# EAGLE design LPEM (EAGLE 6.4)

## Sheet 1 of 2
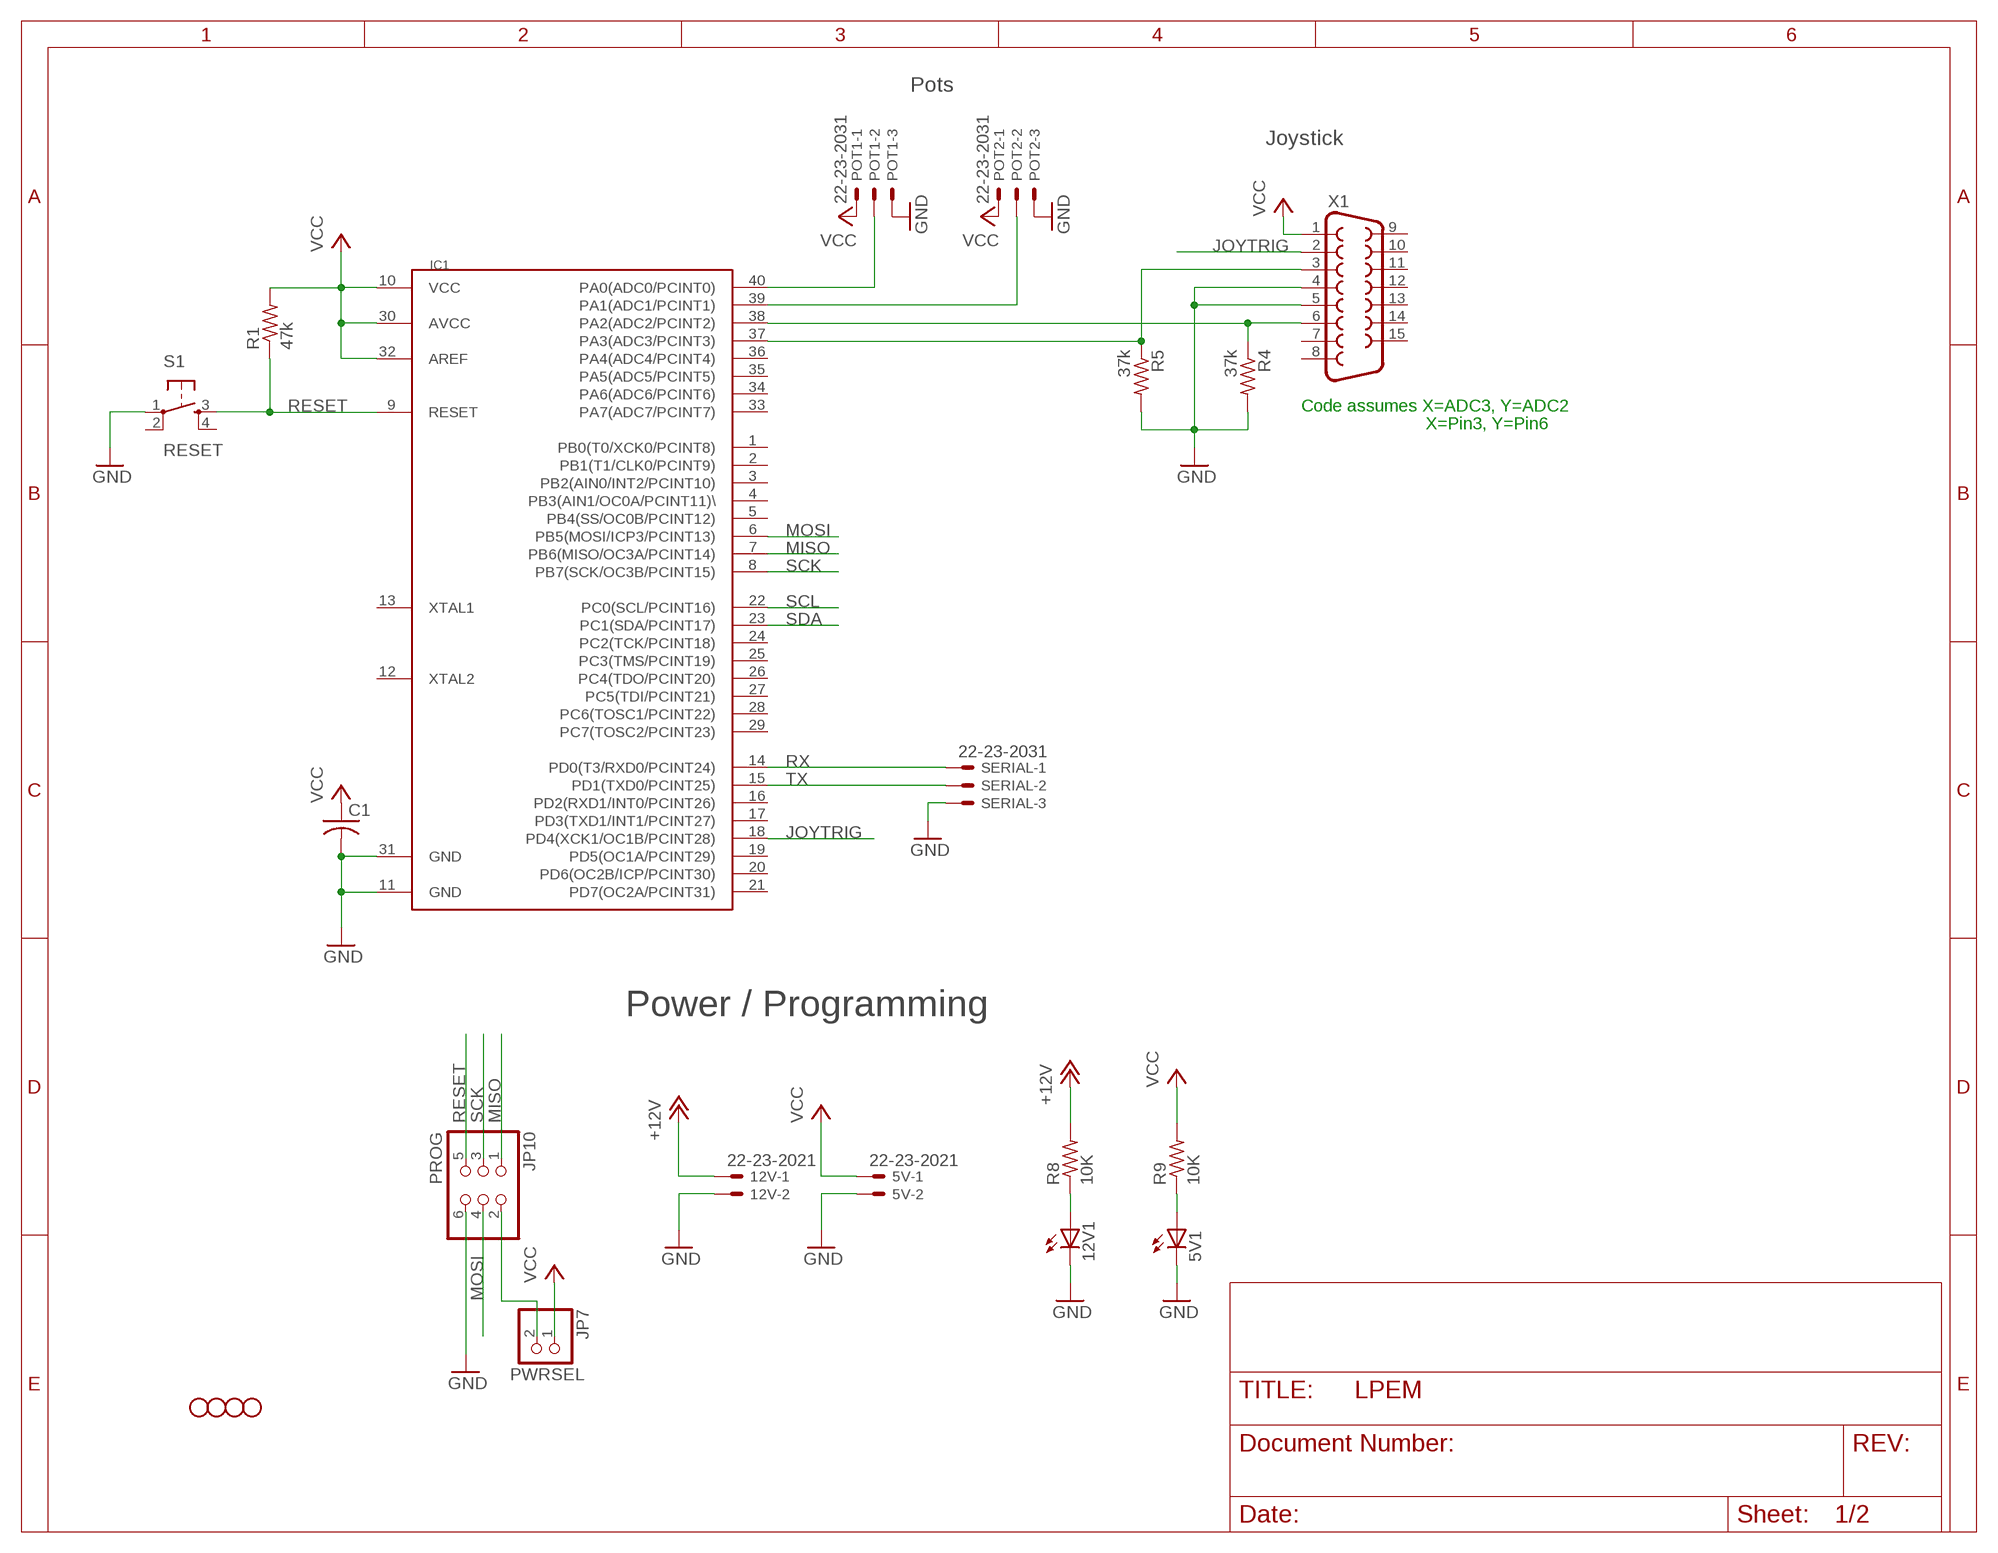
[diagram p0: schematic, sheet 1]

### Parts
5V  22-23-2021  [22-23-2021]
5V1  LED3MM  [LED3MM]
12V  22-23-2021  [22-23-2021]
12V1  LED3MM  [LED3MM]
C1  C-US025-025X050  [C025-025X050]
IC1  MEGA1284P  [DIL40]
JP1  STAND-OFF  [STAND-OFF]
JP2  STAND-OFF  [STAND-OFF]
JP7  PWRSEL  PINHD-1X2  [1X02]
JP8  STAND-OFF  [STAND-OFF]
JP9  STAND-OFF  [STAND-OFF]
JP10  PROG  PINHD-2X3  [2X03]
POT1  22-23-2031  [22-23-2031]
POT2  22-23-2031  [22-23-2031]
R1  47k  R-US_0204/5  [0204/5]
R4  37k  R-US_0204/5  [0204/5]
R5  37k  R-US_0204/5  [0204/5]
R8  10K  R-US_0204/5  [0204/5]
R9  10K  R-US_0204/5  [0204/5]
S1  RESET  TAC_SWITCHPTH  [TACTILE-PTH]
SERIAL  22-23-2031  [22-23-2031]
X1  F15HP  [F15HP]

### Nets
+12V [power]: 12V.1 R8.2 ; also sheet 2
GND [power]: 5V1.K(C) 5V.2 12V1.K(C) 12V.2 C1.2 IC1.11(GND) IC1.31(GND) JP10.6 POT1.3 POT2.3 R4.2 R5.2 S1.1 SERIAL.3 X1.4 X1.5 ; also sheet 2
JOYTRIG: IC1.18(PD4(XCK1/OC1B/PCINT28)) X1.2
MISO: IC1.7(PB6(MISO/OC3A/PCINT14)) JP10.1
MOSI: IC1.6(PB5(MOSI/ICP3/PCINT13)) JP10.4
N$1: IC1.40(PA0(ADC0/PCINT0)) POT1.2
N$2: IC1.39(PA1(ADC1/PCINT1)) POT2.2
N$3: IC1.37(PA3(ADC3/PCINT3)) R5.1 X1.3
N$4: JP7.2 JP10.2
N$5: 5V1.A R9.1
N$6: IC1.38(PA2(ADC2/PCINT2)) R4.1 X1.6
N$7: 12V1.A R8.1
RESET: IC1.9(RESET) JP10.5 R1.1 S1.3
RX: IC1.14(PD0(T3/RXD0/PCINT24)) SERIAL.1
SCK: IC1.8(PB7(SCK/OC3B/PCINT15)) JP10.3
SCL: IC1.22(PC0(SCL/PCINT16)) ; also sheet 2
SDA: IC1.23(PC1(SDA/PCINT17)) ; also sheet 2
TX: IC1.15(PD1(TXD0/PCINT25)) SERIAL.2
VCC [power]: 5V.1 C1.1 IC1.10(VCC) IC1.30(AVCC) IC1.32(AREF) JP7.1 POT1.1 POT2.1 R1.2 R9.2 X1.1 ; also sheet 2
Unconnected: IC1.1(PB0(T0/XCK0/PCINT8)) IC1.2(PB1(T1/CLK0/PCINT9)) IC1.3(PB2(AIN0/INT2/PCINT10)) IC1.4(PB3(AIN1/OC0A/PCINT11)\) IC1.5(PB4(SS/OC0B/PCINT12)) IC1.12(XTAL2) IC1.13(XTAL1) IC1.16(PD2(RXD1/INT0/PCINT26)) IC1.17(PD3(TXD1/INT1/PCINT27)) IC1.19(PD5(OC1A/PCINT29)) IC1.20(PD6(OC2B/ICP/PCINT30)) IC1.21(PD7(OC2A/PCINT31)) IC1.24(PC2(TCK/PCINT18)) IC1.25(PC3(TMS/PCINT19)) IC1.26(PC4(TDO/PCINT20)) IC1.27(PC5(TDI/PCINT21)) IC1.28(PC6(TOSC1/PCINT22)) IC1.29(PC7(TOSC2/PCINT23)) IC1.33(PA7(ADC7/PCINT7)) IC1.34(PA6(ADC6/PCINT6)) IC1.35(PA5(ADC5/PCINT5)) IC1.36(PA4(ADC4/PCINT4)) S1.2 S1.4 X1.7 X1.8 X1.9 X1.10 X1.11 X1.12 X1.13 X1.14 X1.15

### Notes on the sheet
- Pots
- Joystick
- Code assumes X=ADC3, Y=ADC2
- X=Pin3, Y=Pin6
- Power / Programming

## Sheet 2 of 2
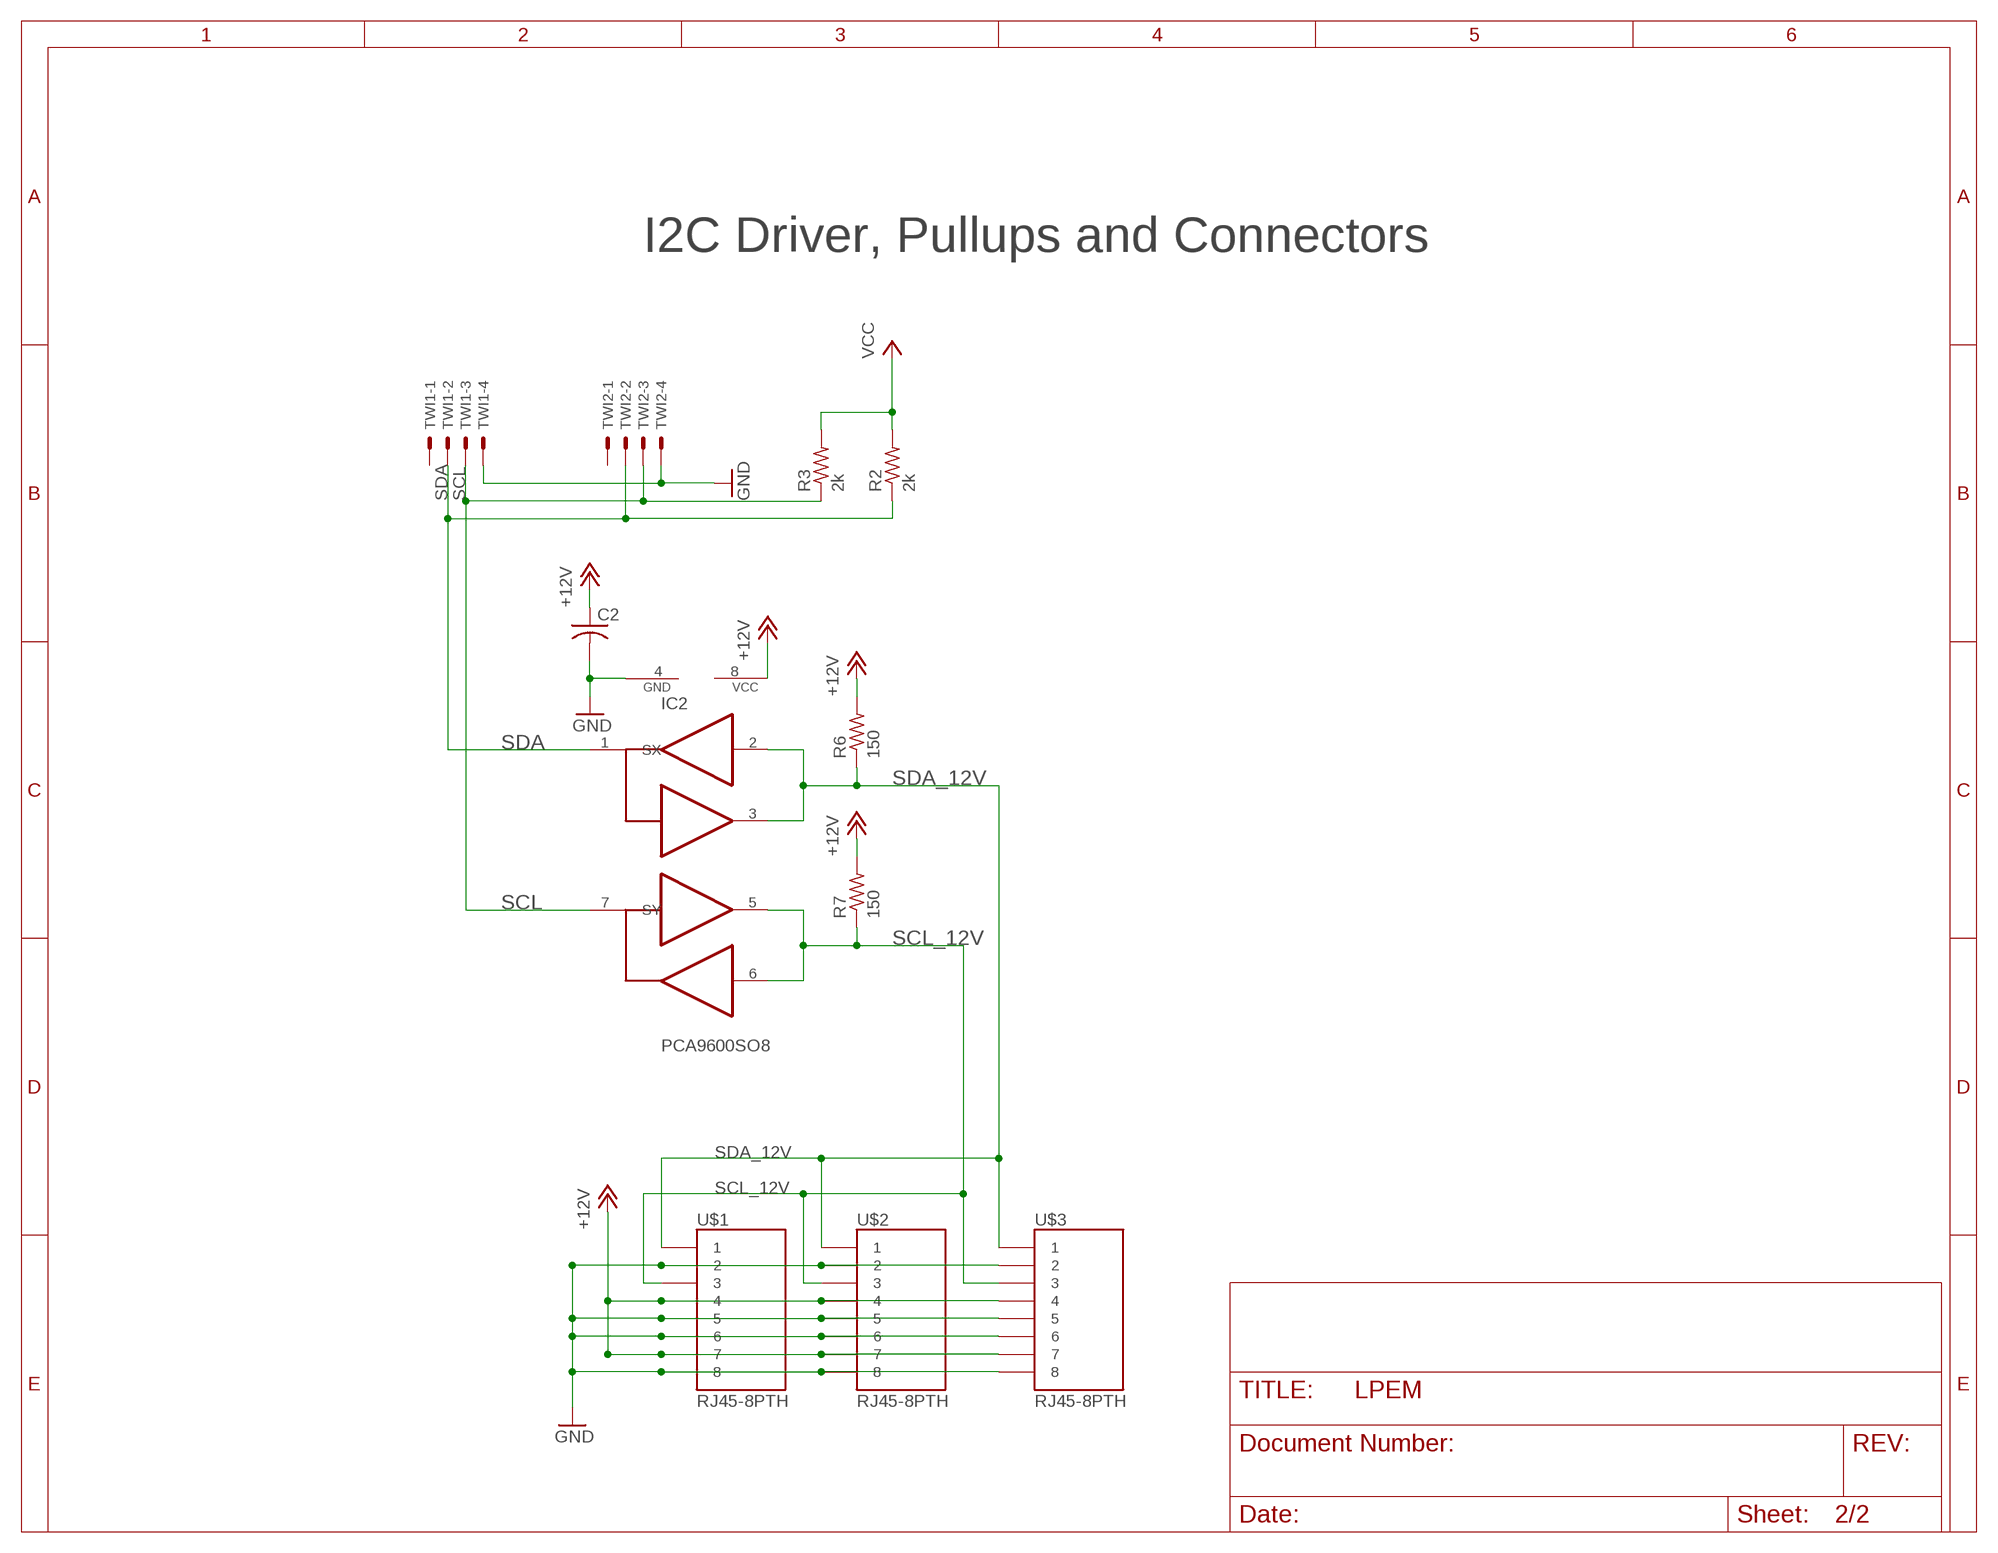
[diagram p1: schematic, sheet 2]

### Parts
C2  C-US025-025X050  [C025-025X050]
IC2  PCA9600SO8  [SO08]
R2  2k  R-US_0204/5  [0204/5]
R3  2k  R-US_0204/5  [0204/5]
R6  150  R-US_0204/5  [0204/5]
R7  150  R-US_0204/5  [0204/5]
TWI1  22-23-2041  [22-23-2041]
TWI2  22-23-2041  [22-23-2041]
U$1  RJ45-8PTH  [RJ45-8]
U$2  RJ45-8PTH  [RJ45-8]
U$3  RJ45-8PTH  [RJ45-8]

### Nets
+12V [power]: C2.1 IC2.8(VCC) R6.2 R7.2 U$1.4 U$1.7 U$2.4 U$2.7 U$3.4 U$3.7 ; also sheet 1
GND [power]: C2.2 IC2.4(GND) TWI1.4 TWI2.4 U$1.2 U$1.5 U$1.6 U$1.8 U$2.2 U$2.5 U$2.6 U$2.8 U$3.2 U$3.5 U$3.6 U$3.8 ; also sheet 1
SCL: IC2.7(SY) R3.1 TWI1.3 TWI2.3 ; also sheet 1
SCL_12V: IC2.5(TY) IC2.6(RY) R7.1 U$1.3 U$2.3 U$3.3
SDA: IC2.1(SX) R2.1 TWI1.2 TWI2.2 ; also sheet 1
SDA_12V: IC2.2(RX) IC2.3(TX) R6.1 U$1.1 U$2.1 U$3.1
VCC [power]: R2.2 R3.2 ; also sheet 1
Unconnected: TWI1.1 TWI2.1

### Notes on the sheet
- I2C Driver, Pullups and Connectors

## Library data of the parts
5V 12V = con-molex:22-23-2021: .100" (2.54mm) Center Header - 2 Pin
5V1 12V1 = led:LED: LED OSRAM: - CHIPLED LG R971, LG N971, LY N971, LG Q971, LY Q971, LO R971, LY R971 LH N974, LH R974 LS Q976, LO Q976, LY Q976 LO Q996 - Hyper CHIPLED LW Q18S LB Q993, LB Q99A, LB R99A - SideLED LS A670, LO A670, LY A670, LG A670, LP A670 LB A673, LV A673, LT A673, LW A673 LH A674 LY A675 LS A676, LA A676, LO A676, LY A676, LW A676 LS A679, LY A679, LG A679 - Hyper Micro SIDELED® LS Y876, LA Y876, LO Y876, LY Y876 LT Y87S - SmartLED LW L88C, LW L88S LB L89C, LB L89S, LG L890 LS L89K, LO L89K, LY L89K LS L896, LA L896, LO L896, LY L896 - TOPLED LS T670, LO T670, LY T670, LG T670, LP T670 LSG T670, LSP T670, LSY T670, LOP T670, LYG T670 LG T671, LOG T671, LSG T671 LB T673, LV T673, LT T673, LW T673 LH T674 LS T676, LA T676, LO T676, LY T676, LB T676, LH T676, LSB T676, LW T676 LB T67C, LV T67C, LT T67C, LS T67K, LO T67K, LY T67K, LW E67C LS E67B, LA E67B, LO E67B, LY E67B, LB E67C, LV E67C, LT E67C LW T67C LS T679, LY T679, LG T679 LS T770, LO T770, LY T770, LG T770, LP T770 LB T773, LV T773, LT T773, LW T773 LH T774 LS E675, LA E675, LY E675, LS T675 LS T776, LA T776, LO T776, LY T776, LB T776 LHGB T686 LT T68C, LB T68C - Hyper Mini TOPLED® LB M676 - Mini TOPLED Santana® LG M470 LS M47K, LO M47K, LY M47K Source: http://www.osram.convergy.de LUXEON: - LUMILED® LXK2-PW12-R00, LXK2-PW12-S00, LXK2-PW14-U00, LXK2-PW14-V00 LXK2-PM12-R00, LXK2-PM12-S00, LXK2-PM14-U00 LXK2-PE12-Q00, LXK2-PE12-R00, LXK2-PE12-S00, LXK2-PE14-T00, LXK2-PE14-U00 LXK2-PB12-K00, LXK2-PB12-L00, LXK2-PB12-M00, LXK2-PB14-N00, LXK2-PB14-P00, LXK2-PB14-Q00 LXK2-PR12-L00, LXK2-PR12-M00, LXK2-PR14-Q00, LXK2-PR14-R00 LXK2-PD12-Q00, LXK2-PD12-R00, LXK2-PD12-S00 LXK2-PH12-R00, LXK2-PH12-S00 LXK2-PL12-P00, LXK2-PL12-Q00, LXK2-PL12-R00 Source: www.luxeon.com KINGBRIGHT: KA-3528ASYC Source: www.kingbright.com
C1 C2 = rcl:C-US: CAPACITOR, American symbol
IC1 = 1284p:MEGA1284P: Atmel ATmega1284P 8-bit AVR Microcontroller
IC2 = 4534_I2C2:PCA9600: I2C ACTIVE TERMINATOR SO-8
JP1 JP2 JP8 JP9 = SparkFun:STAND-OFF: Stand Off This is the mechanical footprint for a #4 phillips button head screw. Use the keepout ring to avoid running the screw head into surrounding components. SKU : PRT-00447
JP7 = pinhead:PINHD-1X2: PIN HEADER
JP10 = pinhead:PINHD-2X3: PIN HEADER
POT1 POT2 SERIAL = con-molex:22-23-2031: .100" (2.54mm) Center Header - 3 Pin
R1-R9 = rcl:R-US_: RESISTOR, American symbol
S1 = SparkFun:TAC_SWITCH: Momentary Switch Button commonly used for reset or general input. Spark Fun Electronics SKU : COM-00097
TWI1 TWI2 = con-molex:22-23-2041: .100" (2.54mm) Center Header - 4 Pin
U$1-U$3 = SparkFun:RJ45-8: RJ45 Jack Simple RJ45, 8-pin connection - connector for common Cat5, Cat5e, and Cat6 Ethernet cables. Footprint not yet proven in production. Connector sku is PRT-00643; Breakout PCB sku is BOB-00716.
X1 = con-subd:F15: SUB-D

## Net classes
0 default: width 0.152 mm, drill 0.152 mm, clearance 0.152 mm
1 power: width 0.305 mm, drill 0.305 mm, clearance 0.152 mm to class 0, clearance 0.152 mm

## Board
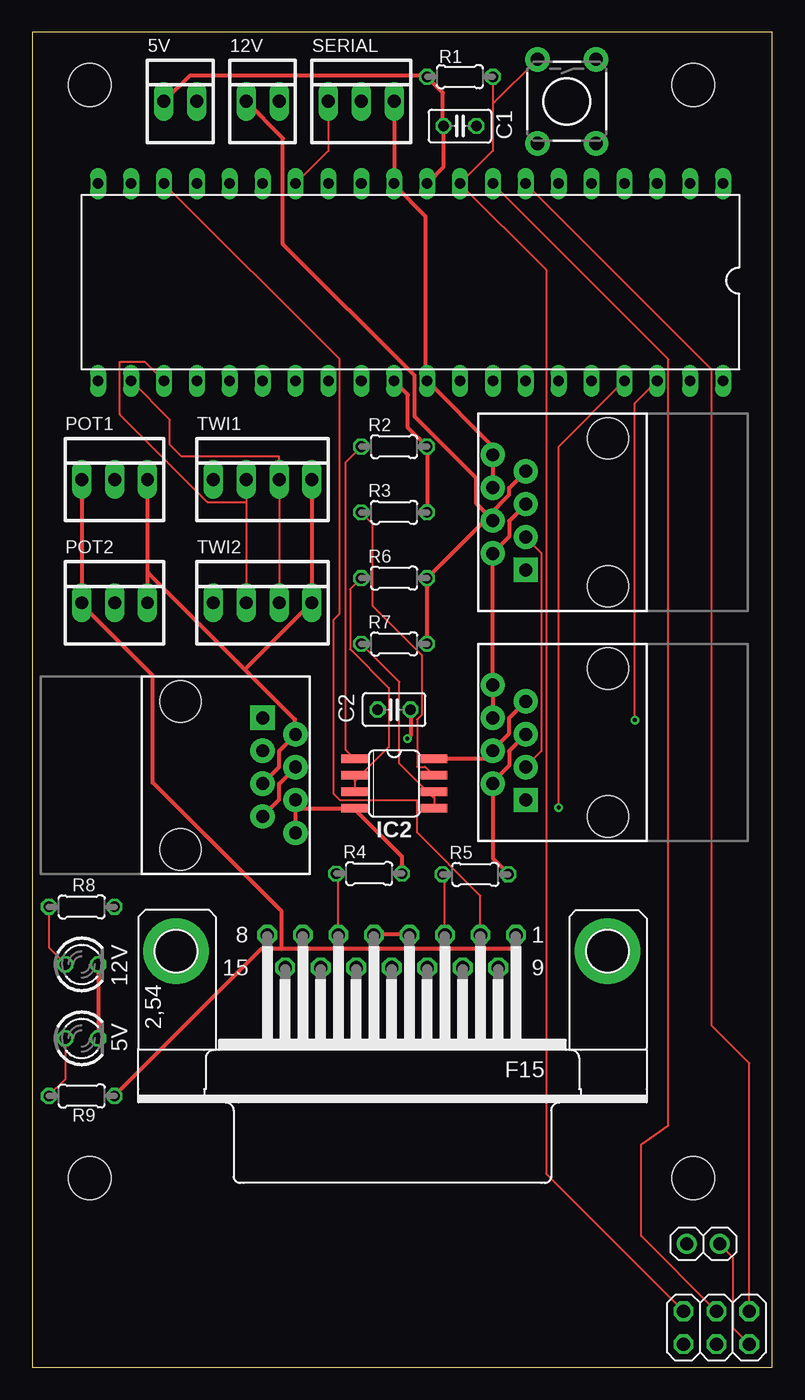
[diagram p2: board, top side]
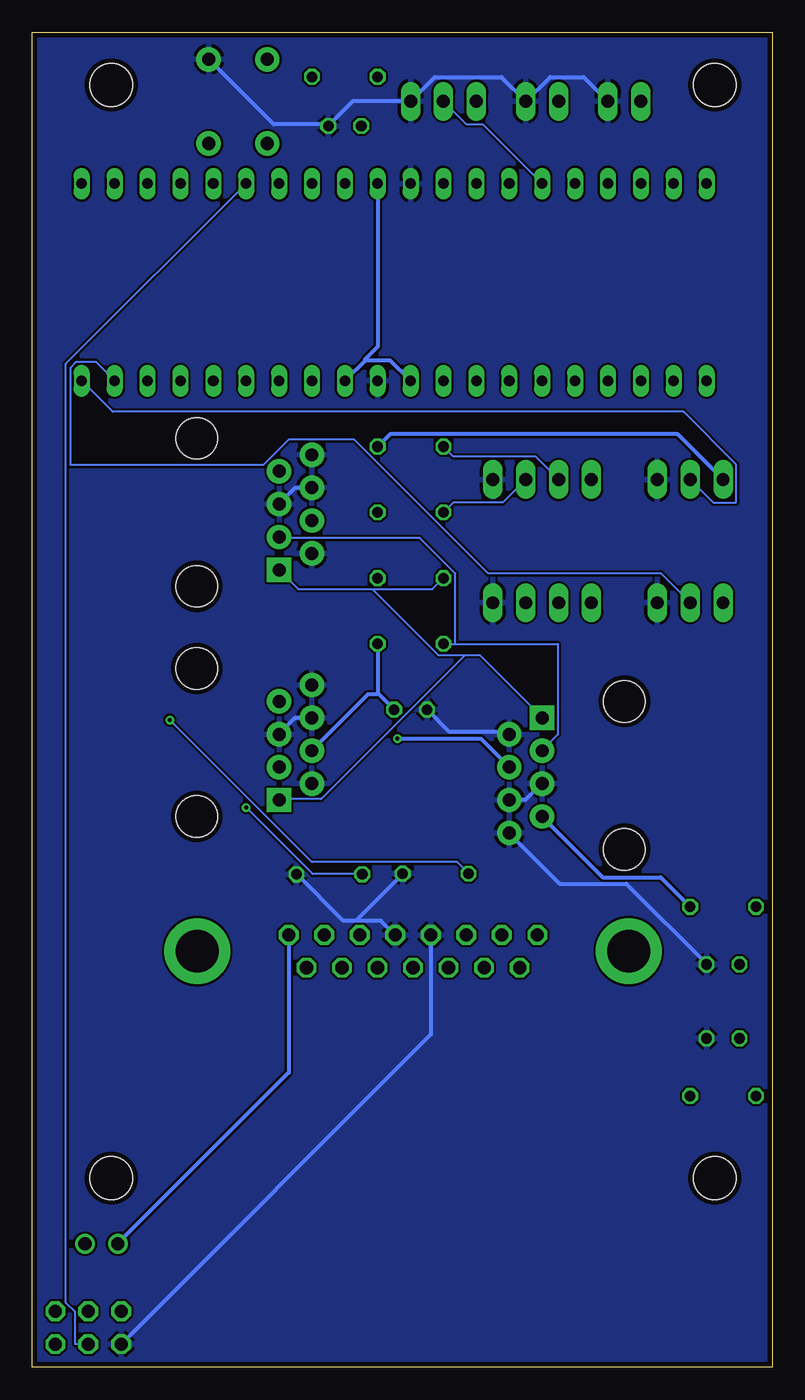
[diagram p3: board, bottom side, seen from below]

Size 57.15 x 103.12 mm. Coordinates in mm from the lower left corner, seen from the top.
Outline: 0,0 57.15,0 57.15,103.12 0,103.12 0,0
Copper layers (1*16): Top 0.0356mm / dielectric 1.5011mm / Bottom 0.0356mm
Design rules "DorkbotPDX *": minimum track width 6mil, minimum drill 12mil, track to track 7mil, track to pad 7mil, pad to pad 7mil, via to via 7mil, smd to smd 6mil, copper to edge 15mil, drill to drill 15mil, minimum pad ring 7mil, minimum via ring 7mil, stop-mask expansion 4mil, vias tented up to drill 0mil, thermal gap 10mil
tRestrict: area -1.3,100.6 to 6.3,104.4; area -1,96.8 to 2.3,100.6

### Footprints (pad centres in the part's own frame; a part is rotated, then mirrored left to right if it is on the bottom)
22-23-2021 = drill 1 long: 1 -1.27,0; 2 1.27,0
LED3MM = drill 0.813 octagon: A -1.27,0; K 1.27,0
C025-025X050 = drill 0.813 octagon: 1 -1.27,0; 2 1.27,0
DIL40 = drill 0.813 long: 1 -24.13,-7.62; 2 -21.59,-7.62; 3 -19.05,-7.62; 4 -16.51,-7.62; 5 -13.97,-7.62; 6 -11.43,-7.62; 7 -8.89,-7.62; 8 -6.35,-7.62; 9 -3.81,-7.62; 10 -1.27,-7.62; 11 1.27,-7.62; 12 3.81,-7.62; 13 6.35,-7.62; 14 8.89,-7.62; 15 11.43,-7.62; 16 13.97,-7.62; 17 16.51,-7.62; 18 19.05,-7.62; 19 21.59,-7.62; 20 24.13,-7.62; 21 24.13,7.62; 22 21.59,7.62; 23 19.05,7.62; 24 16.51,7.62; 25 13.97,7.62; 26 11.43,7.62; 27 8.89,7.62; 28 6.35,7.62; 29 3.81,7.62; 30 1.27,7.62; 31 -1.27,7.62; 32 -3.81,7.62; 33 -6.35,7.62; 34 -8.89,7.62; 35 -11.43,7.62; 36 -13.97,7.62; 37 -16.51,7.62; 38 -19.05,7.62; 39 -21.59,7.62; 40 -24.13,7.62
SO08 = smd 0.66 x 2.032: 1 -1.905,-3.073; 2 -0.635,-3.073; 3 0.635,-3.073; 4 1.905,-3.073; 5 1.905,3.073; 6 0.635,3.073; 7 -0.635,3.073; 8 -1.905,3.073
STAND-OFF = hole 3.302: 0,0
1X02 = drill 1.016: 1 -1.27,0; 2 1.27,0
2X03 = drill 1.016 octagon: 1 -2.54,-1.27; 2 -2.54,1.27; 3 0,-1.27; 4 0,1.27; 5 2.54,-1.27; 6 2.54,1.27
22-23-2031 = drill 1 long: 1 -2.54,0; 2 0,0; 3 2.54,0
0204/5 = drill 0.813 octagon: 1 -2.54,0; 2 2.54,0
TACTILE-PTH = drill 1.016 pad 1.88: 1 -3.251,2.261; 2 3.251,2.261; 3 -3.251,-2.261; 4 3.251,-2.261
22-23-2041 = drill 1 long: 1 -3.81,0; 2 -1.27,0; 3 1.27,0; 4 3.81,0
RJ45-8 = drill 1 pad 1.88 square: 1 -4.445,6.35 | drill 1 pad 1.88: 2 -3.175,8.89; 3 -1.905,6.35; 4 -0.635,8.89; 5 0.635,6.35; 6 1.905,8.89; 7 3.175,6.35; 8 4.445,8.89 | hole 3.2: -5.715,0; 5.715,0
F15HP = drill 1.016 octagon: 1 -9.601,-1.27; 2 -6.858,-1.27; 3 -4.115,-1.27; 4 -1.372,-1.27; 5 1.372,-1.27; 6 4.115,-1.27; 7 6.858,-1.27; 8 9.601,-1.27; 9 -8.23,1.27; 10 -5.486,1.27; 11 -2.743,1.27; 12 0,1.27; 13 2.743,1.27; 14 5.486,1.27; 15 8.23,1.27 | drill 3.302 pad 5.08: G1 -16.662,0; G2 16.662,0

### Placement (x,y rotation side)
5V  11.43,97.79 0 top
5V1  3.81,25.4 0 top
12V  17.78,97.79 0 top
12V1  3.81,31.11 0 top
C1  33.02,95.88 0 top
C2  27.94,50.8 180 top
IC1  29.21,83.82 180 top
IC2  27.94,45.08 270 top
JP1  4.45,99.06 0 top
JP2  51.05,99.06 0 top
JP7  51.82,9.53 0 top
JP8  4.45,14.61 0 top
JP9  51.05,14.61 0 top
JP10  52.83,3.05 180 top
POT1  6.35,68.58 0 top
POT2  6.35,59.06 0 top
R1  33.02,99.69 180 top
R2  27.94,71.12 0 top
R3  27.94,66.04 0 top
R4  26.01,38.13 0 top
R5  34.21,38.07 0 top
R6  27.94,60.96 0 top
R7  27.94,55.88 0 top
R8  3.81,35.56 0 top
R9  3.81,20.95 0 top
S1  41.27,97.79 270 top
SERIAL  25.4,97.79 0 top
TWI1  17.78,68.58 0 top
TWI2  17.78,59.06 0 top
U$1  44.45,48.26 90 top
U$2  44.45,66.04 90 top
U$3  11.43,45.72 270 top
X1  27.75,32.13 180 top

### Tracks (layer width: path | path; a pad name or v marks a point on that pad's centre or on a via)
+12V  (via drill 0.3)
  Top 0.305: U$3.4 20.32,46.33 19.05,45.06 19.05,43.84 17.78,42.57 U$3.7 | IC2.8 35.56,46.99 U$1.4 35.61,47.75 36.83,48.97 36.83,50.14 38.1,51.41 U$1.7 | R7.2 R6.2 35.15,65.63 U$2.4 | 12V.1 19.36,94.94 19.36,86.77 29.52,76.61 29.52,73.46 34.29,68.68 34.29,66.7 35.56,65.43 U$2.4 | U$2.7 38.1,69.19 36.83,67.92 36.83,67.41 35.31,65.89 U$2.4 | v28.96,48.56 29.21,48.82 C2.1
  Bottom 0.305: R8.2 8.64,37.85 13.11,37.85 17.78,42.52 U$3.7 | 30.48,52.07 C2.1 | R7.2 30.48,52.07 | U$1.4 35.56,47.65 31.24,51.97 30.58,51.97 30.48,52.07 | v28.96,48.56 22.5,48.56 20.32,46.38 U$3.4
GND
  Top 0.305: TWI1.4 TWI2.4 21.49,58.98 16.41,53.9 | POT1.3 8.89,61.32 | 8.89,61.32 POT2.3 | 24.89,43.18 IC2.4 | R4.2 28.55,39.42 24.89,43.08 IC2.4 | 12V1.K 5V1.K | U$3.8 U$3.6 20.42,43.18 IC2.4 | U$3.5 17.78,45.11 19.05,46.38 19.05,47.6 20.32,48.87 U$3.2 20.27,49.02 20.27,50.04 16.41,53.9 | 16.41,53.9 8.99,61.32 8.89,61.32 | SERIAL.3 IC1.11 27.94,91.34 30.38,88.9 30.38,76.3 IC1.31 35.56,71.12 U$2.8 U$2.6 | U$2.5 38.1,66.65 36.83,65.38 36.83,64.16 35.56,62.89 U$2.2 U$1.8 U$1.6 | R5.2 36.78,38.1 35.56,39.32 U$1.2 35.56,45.21 36.83,46.48 36.83,47.6 38.1,48.87 U$1.5 | X1.5 26.42,33.43 29.11,33.43 X1.4
  Bottom 0.305: C2.2 24.94,49.07 20.47,49.07 20.32,48.92 U$3.2 | U$3.5 17.78,45.11 19.05,43.84 20.32,43.84 U$3.6 | 12V1.K 5.08,31.14 11.28,37.34 16.41,37.34 20.32,41.25 U$3.8 | 5V.2 14.58,99.67 17.17,99.67 12V.2 20.93,99.67 26.06,99.67 SERIAL.3 32.41,97.79 34.29,95.91 C1.2 34.39,96.01 38.51,96.01 S1.1 | U$2.5 38.1,66.7 36.88,67.92 35.56,67.92 U$2.6 | U$1.5 38.1,48.92 36.88,50.14 35.56,50.14 U$1.6 | JP10.6 26.36,25.7 26.36,33.38 X1.5 | 32.05,34.49 30.23,34.49 29.16,33.43 X1.4 | 32.05,34.49 33.12,34.49 36.73,38.1 R5.2 | R4.2 28.55,38.1 32.05,34.59 32.05,34.49
  pour Bottom: 0,104.14 59.05,104.14 58.42,-0.63 0,-0.63
JOYTRIG
  Top 0.152: IC1.18 23.72,77.88 23.72,58.22 23.27,57.76 23.27,44.3 23.77,43.79 29.72,43.79 29.72,41.3 34.59,36.42 34.59,33.43 X1.2
MISO
  Top 0.152: IC1.7 52.48,77.06 52.48,26.36 55.37,23.47 JP10.1
MOSI
  Bottom 0.152: IC1.6 54.56,77.52 54.56,4.98 53.85,4.27 53.85,1.78 JP10.4
N$1
  Bottom 0.152: IC1.40 50.95,73.81 6.86,73.81 2.79,69.75 2.79,66.8 4.57,66.8 POT1.2
N$2
  Bottom 0.152: IC1.39 52.27,77.67 53.75,77.67 54.2,77.22 54.2,69.7 39.32,69.7 37.34,71.68 32.31,71.68 21.95,61.32 8.59,61.32 6.35,59.08 POT2.2
N$3  (via drill 0.3)
  Top 0.152: R5.1 31.85,37.9 31.85,33.43 X1.3 | IC1.37 40.64,71.12 v40.64,43.23
  Bottom 0.152: v40.64,43.23 35.51,38.1 31.7,38.1 R5.1
N$4
  Top 0.152: JP10.2 54.1,3.05 54.1,8.48 53.09,9.5 JP7.2
N$5
  Top 0.152: 5V1.A 2.54,22.25 1.27,20.98 R9.1
N$6  (via drill 0.3)
  Top 0.152: R4.1 23.47,38.1 23.62,37.95 23.62,33.43 X1.6 | IC1.38 46.53,74.47 v46.53,49.99
  Bottom 0.152: v46.53,49.99 35.56,39.01 24.33,39.01 23.47,38.15 R4.1
N$7
  Top 0.152: R8.1 1.27,32.41 2.54,31.14 12V1.A
RESET
  Top 0.152: R1.1 35.56,97.64 | 35.56,97.64 35.56,93.98 IC1.9 39.67,84.78 39.67,14.94 JP10.5 | S1.3 35.61,97.64 35.56,97.64
RX
  Top 0.152: IC1.14 22.86,93.98 SERIAL.1
SCK
  Top 0.152: IC1.8 49.12,77.88 49.12,18.67 47.02,17.2 47.02,10.13 JP10.3
SCL
  Top 0.152: R3.1 26.26,65.18 26.26,58.83 30.07,55.02 30.07,50.39 29.72,50.04 29.72,46.38 30.33,46.38 30.99,45.72 IC2.7 | IC1.22 10.62,73.2 10.62,71.27 11.53,70.36 19.05,70.36 TWI1.3 TWI2.3
  Bottom 0.152: R3.1 24.64,66.8 20.83,66.8 TWI1.3
SCL_12V
  Top 0.152: U$1.3 38.1,46.38 39.32,47.6 39.32,62.89 38.1,64.11 U$2.3 | 31.04,43.99 31.04,44.45 IC2.6 | 31.04,43.99 31.04,43.18 IC2.5 | R7.1 28.35,52.93 28.35,46.63 30.99,43.99 31.04,43.99
  Bottom 0.152: R7.1 24.49,55.88 | 24.49,55.88 16.56,55.88 16.56,48.87 17.78,47.65 U$3.3 | 24.49,55.88 24.49,61.32 27.23,64.06 38,64.06 38.1,64.16 U$2.3
SDA
  Top 0.152: R2.1 24.18,69.9 24.18,47.7 24.89,46.99 IC2.1 | IC1.23 8.69,77.67 6.76,77.67 6.76,73.61 13.56,66.8 16.51,66.8 | TWI1.2 16.51,66.8 | 16.51,66.8 TWI2.2
  Bottom 0.152: R2.1 24.64,70.36 18.29,70.36 TWI1.2
SDA_12V
  Top 0.152: 24.89,45.31 24.89,45.72 IC2.2 | 24.89,45.31 24.89,44.45 IC2.3 | R6.1 24.54,60.1 24.54,55.47 27.53,52.48 27.53,47.9 24.94,45.31 24.89,45.31
  Bottom 0.152: R6.1 26.26,60.1 30.84,60.1 | 30.84,60.1 36.63,60.1 38.1,61.57 U$2.1 | 23.77,55.02 25.81,55.02 30.84,60.05 30.84,60.1 | 23.77,55.02 22.61,55.02 17.78,50.19 U$3.1 | U$1.1 38.1,43.84 38.05,43.89 34.85,43.89 23.77,54.97 23.77,55.02
TX
  Bottom 0.152: IC1.15 22.35,96.01 23.62,96.01 SERIAL.2
VCC
  Top 0.305: R3.2 R2.2 29.01,72.59 29.01,75.13 IC1.30 | IC1.10 31.75,92.71 C1.1 31.7,96.01 31.7,98.45 30.48,99.67 R1.2 30.38,99.77 12.14,99.77 5V.1 | POT1.1 POT2.1 3.81,58.93 9.3,53.44 9.3,45.16 19.25,35.2 19.25,32.31 | 19.25,32.31 37.34,32.31 37.34,33.38 X1.1 | 19.25,32.31 17.68,32.31 6.35,20.98 R9.2
  Bottom 0.305: 31.45,77.77 IC1.32 | 31.45,77.77 29.52,77.77 IC1.30 | IC1.10 30.48,78.84 31.45,77.88 31.45,77.77 | JP7.1 50.55,9.55 37.34,22.76 37.34,33.38 X1.1 | R2.2 29.52,72.08 7.32,72.08 POT1.1

### Text on the board
tNames: 12V | 5V
tDocu: RESET | 5V | GND | 12V | GND | RX | TX | GND | LPEM v2.0 -- September 2017 | 1